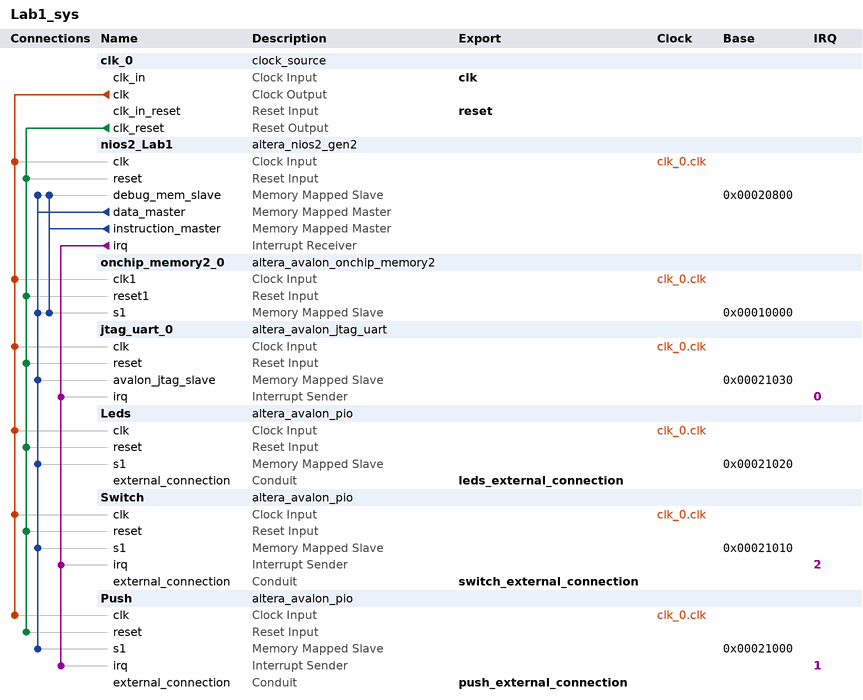
[diagram p0: system contents]
# Platform Designer (Qsys) system Lab1_sys, MAX 10 10M50DAF484C7G
# Parameters at their usual value, and those the tool derives, are not listed.
package require -exact qsys 18.1
create_system Lab1_sys
set_project_property DEVICE_FAMILY {MAX 10}
set_project_property DEVICE 10M50DAF484C7G

add_instance clk_0 clock_source 18.1
set_instance_parameter_value clk_0 clockFrequency 50000000

add_instance nios2_Lab1 altera_nios2_gen2 18.1
set_instance_parameter_value nios2_Lab1 dcache_size 2048
set_instance_parameter_value nios2_Lab1 exceptionSlave onchip_memory2_0.s1
set_instance_parameter_value nios2_Lab1 icache_size 4096
set_instance_parameter_value nios2_Lab1 impl Tiny
set_instance_parameter_value nios2_Lab1 resetSlave onchip_memory2_0.s1

add_instance onchip_memory2_0 altera_avalon_onchip_memory2 18.1
set_instance_parameter_value onchip_memory2_0 dataWidth 32
set_instance_parameter_value onchip_memory2_0 dualPort false
set_instance_parameter_value onchip_memory2_0 initMemContent true
set_instance_parameter_value onchip_memory2_0 initializationFileName onchip_mem.hex
set_instance_parameter_value onchip_memory2_0 memorySize 40960

add_instance jtag_uart_0 altera_avalon_jtag_uart 18.1
set_instance_parameter_value jtag_uart_0 simInteractiveOptions NO_INTERACTIVE_WINDOWS

add_instance Leds altera_avalon_pio 18.1
set_instance_parameter_value Leds direction Output
set_instance_parameter_value Leds width 8

add_instance Switch altera_avalon_pio 18.1
set_instance_parameter_value Switch captureEdge true
set_instance_parameter_value Switch direction Input
set_instance_parameter_value Switch edgeType ANY
set_instance_parameter_value Switch generateIRQ true
set_instance_parameter_value Switch irqType EDGE
set_instance_parameter_value Switch width 4

add_instance Push altera_avalon_pio 18.1
set_instance_parameter_value Push captureEdge true
set_instance_parameter_value Push direction Input
set_instance_parameter_value Push generateIRQ true
set_instance_parameter_value Push irqType EDGE
set_instance_parameter_value Push width 1

# connections
add_connection clk_0.clk jtag_uart_0.clk clock
add_connection clk_0.clk Leds.clk clock
add_connection clk_0.clk nios2_Lab1.clk clock
add_connection clk_0.clk onchip_memory2_0.clk1 clock
add_connection clk_0.clk Push.clk clock
add_connection clk_0.clk Switch.clk clock
add_connection clk_0.clk_reset jtag_uart_0.reset reset
add_connection clk_0.clk_reset Leds.reset reset
add_connection clk_0.clk_reset nios2_Lab1.reset reset
add_connection clk_0.clk_reset onchip_memory2_0.reset1 reset
add_connection clk_0.clk_reset Push.reset reset
add_connection clk_0.clk_reset Switch.reset reset
add_connection nios2_Lab1.data_master jtag_uart_0.avalon_jtag_slave avalon
set_connection_parameter_value nios2_Lab1.data_master/jtag_uart_0.avalon_jtag_slave baseAddress 0x00021030
add_connection nios2_Lab1.data_master Leds.s1 avalon
set_connection_parameter_value nios2_Lab1.data_master/Leds.s1 baseAddress 0x00021020
add_connection nios2_Lab1.data_master nios2_Lab1.debug_mem_slave avalon
set_connection_parameter_value nios2_Lab1.data_master/nios2_Lab1.debug_mem_slave baseAddress 0x00020800
add_connection nios2_Lab1.data_master onchip_memory2_0.s1 avalon
set_connection_parameter_value nios2_Lab1.data_master/onchip_memory2_0.s1 baseAddress 0x00010000
add_connection nios2_Lab1.data_master Push.s1 avalon
set_connection_parameter_value nios2_Lab1.data_master/Push.s1 baseAddress 0x00021000
add_connection nios2_Lab1.data_master Switch.s1 avalon
set_connection_parameter_value nios2_Lab1.data_master/Switch.s1 baseAddress 0x00021010
add_connection nios2_Lab1.instruction_master nios2_Lab1.debug_mem_slave avalon
set_connection_parameter_value nios2_Lab1.instruction_master/nios2_Lab1.debug_mem_slave baseAddress 0x00020800
add_connection nios2_Lab1.instruction_master onchip_memory2_0.s1 avalon
set_connection_parameter_value nios2_Lab1.instruction_master/onchip_memory2_0.s1 baseAddress 0x00010000
add_connection nios2_Lab1.irq jtag_uart_0.irq interrupt
set_connection_parameter_value nios2_Lab1.irq/jtag_uart_0.irq irqNumber 0
add_connection nios2_Lab1.irq Push.irq interrupt
set_connection_parameter_value nios2_Lab1.irq/Push.irq irqNumber 1
add_connection nios2_Lab1.irq Switch.irq interrupt
set_connection_parameter_value nios2_Lab1.irq/Switch.irq irqNumber 2

# exported interfaces
add_interface clk clock sink
set_interface_property clk EXPORT_OF clk_0.clk_in
add_interface leds_external_connection conduit end
set_interface_property leds_external_connection EXPORT_OF Leds.external_connection
add_interface push_external_connection conduit end
set_interface_property push_external_connection EXPORT_OF Push.external_connection
add_interface reset reset sink
set_interface_property reset EXPORT_OF clk_0.clk_in_reset
add_interface switch_external_connection conduit end
set_interface_property switch_external_connection EXPORT_OF Switch.external_connection

set_interconnect_requirement {$system} qsys_mm.clockCrossingAdapter HANDSHAKE
set_interconnect_requirement {$system} qsys_mm.enableEccProtection FALSE
set_interconnect_requirement {$system} qsys_mm.insertDefaultSlave FALSE
set_interconnect_requirement {$system} qsys_mm.maxAdditionalLatency 1

save_system Lab1_sys.qsys
